# EAGLE design Mega_Shield-v13 (EAGLE 6.5.0)
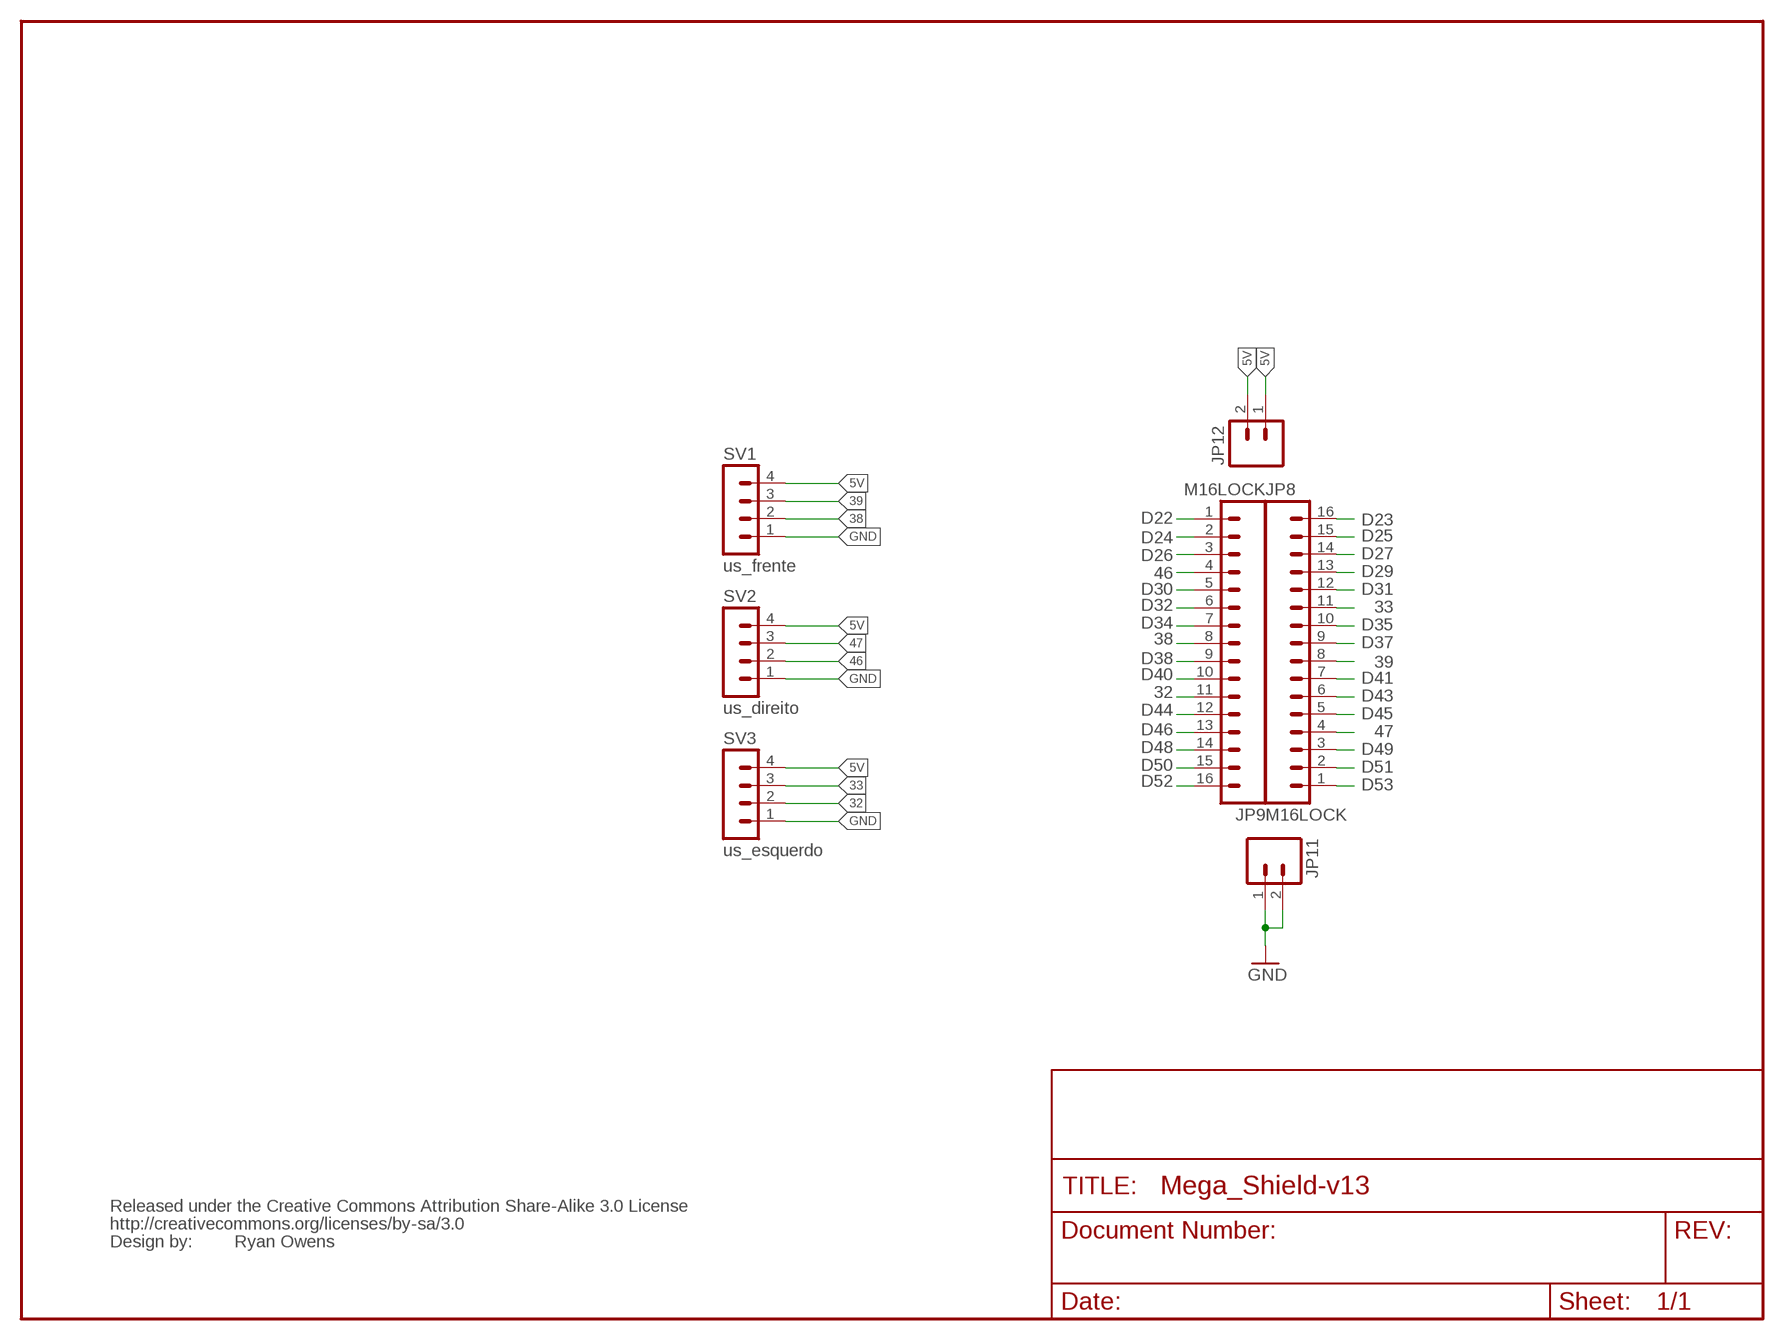
[diagram p0: schematic, sheet 1]

## Parts
JP8  M16LOCK  [1X16_LOCK]
JP9  M16LOCK  [1X16_LOCK]
JP11  M02LOCK  [1X02_LOCK]
JP12  M02LOCK  [1X02_LOCK]
SV1  us_frente  MA04-1  [MA04-1]
SV2  us_direito  MA04-1  [MA04-1]
SV3  us_esquerdo  MA04-1  [MA04-1]
U$2  CREATIVE_COMMONS  [CREATIVE_COMMONS]

## Nets
5V: JP12.1 JP12.2 SV1.4 SV2.4 SV3.4
32: JP9.11 SV3.2
33: JP8.11 SV3.3
38: JP9.8 SV1.2
39: JP8.8 SV1.3
46: JP9.4 SV2.2
47: JP8.4 SV2.3
D22: JP9.1
D23: JP8.16
D24: JP9.2
D25: JP8.15
D26: JP9.3
D27: JP8.14
D29: JP8.13
D30: JP9.5
D31: JP8.12
D32: JP9.6
D34: JP9.7
D35: JP8.10
D37: JP8.9
D38: JP9.9
D40: JP9.10
D41: JP8.7
D43: JP8.6
D44: JP9.12
D45: JP8.5
D46: JP9.13
D48: JP9.14
D49: JP8.3
D50: JP9.15
D51: JP8.2
D52: JP9.16
D53: JP8.1
GND: JP11.1 JP11.2 SV1.1 SV2.1 SV3.1

## Notes on the sheet
- Ryan Owens

## Library data of the parts
JP8 JP9 = SparkFun:M16
JP11 JP12 = SparkFun:M02: Header 2 Standard 2-pin 0.1" header. Use with straight break away headers (SKU : PRT-00116), right angle break away headers (PRT-00553), swiss pins (PRT-00743), machine pins (PRT-00117), and female headers (PRT-00115). Molex polarized connector foot print use with SKU : PRT-08233 with associated crimp pins and housings.
SV1-SV3 = con-lstb:MA04-1: PIN HEADER; OC_FARNELL: unknown; OC_NEWARK: unknown
U$2 = SparkFun:CREATIVE_COMMONS

## Board
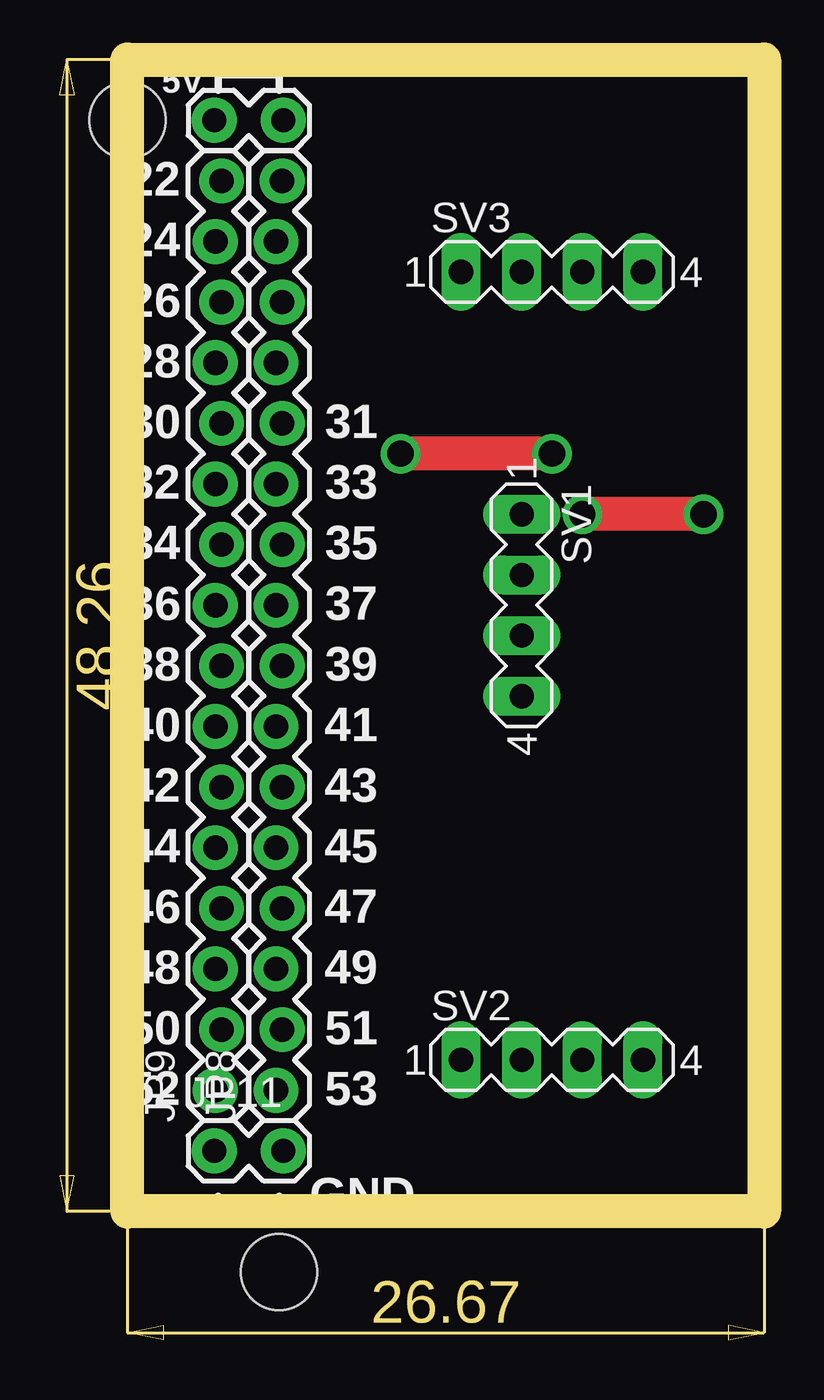
[diagram p1: board, top side]
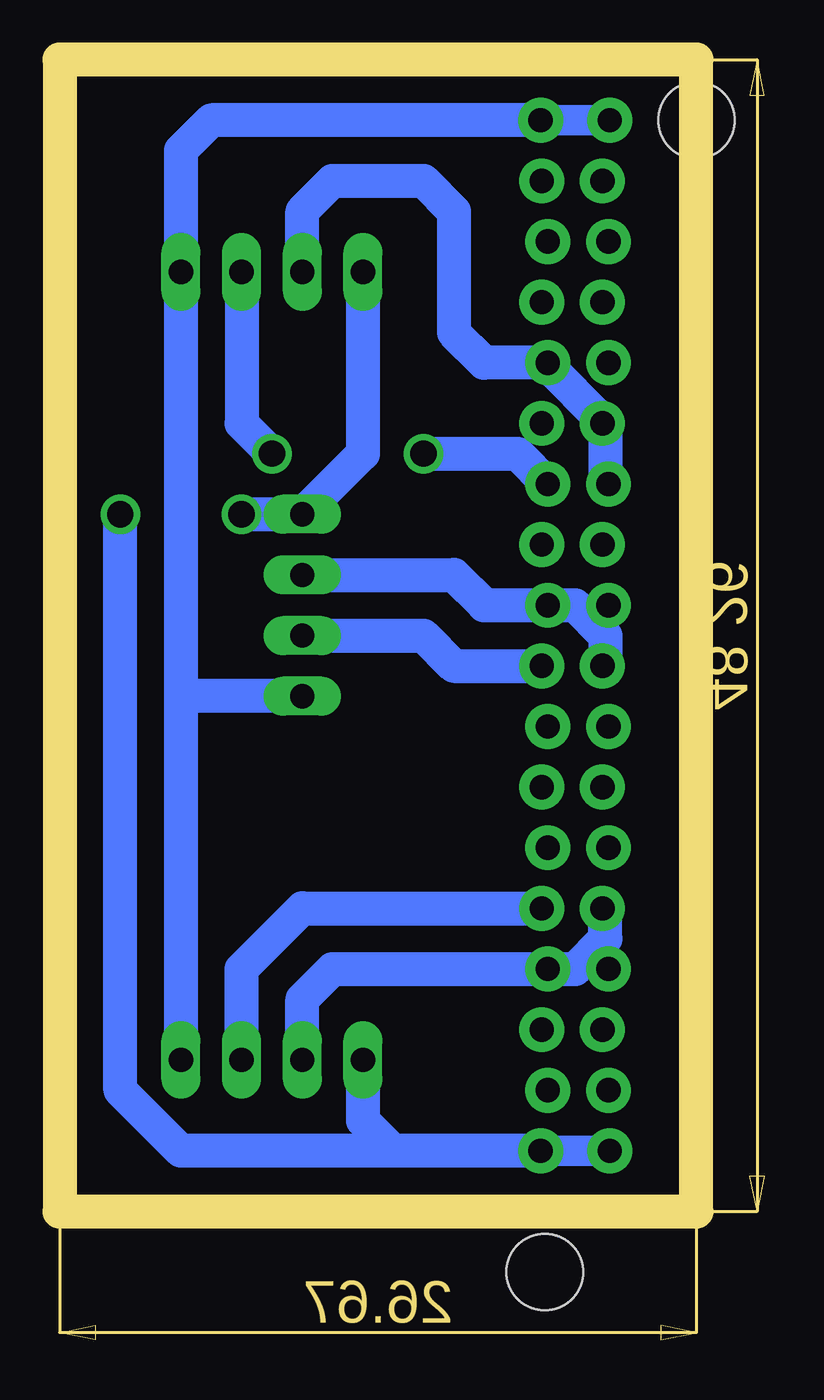
[diagram p2: board, bottom side, seen from below]

Size 26.67 x 48.26 mm. Coordinates in mm from the lower left corner, seen from the top.
Outline: 0,48.26 26.67,48.26 26.67,0 0,0 0,48.26
Copper layers (1*16): Top 0.035mm / dielectric 1.5mm / Bottom 0.035mm
Design rules "SparkFun": minimum track width 8mil, minimum drill 20mil, track to track 8mil, track to pad 8mil, pad to pad 8mil, via to via 8mil, smd to smd 8mil, copper to edge 10mil, drill to drill 8mil, minimum pad ring 12mil, minimum via ring 10mil, stop-mask expansion 4mil, vias tented up to drill 25mil, thermal gap 10mil
Holes 3.2 mm at 0,45.72 6.35,-2.54

### Footprints (pad centres in the part's own frame; a part is rotated, then mirrored left to right if it is on the bottom)
1X16_LOCK = drill 1.016 pad 1.88: 1 0,0.127; 2 2.54,-0.127; 3 5.08,0.127; 4 7.62,-0.127; 5 10.16,0.127; 6 12.7,-0.127; 7 15.24,0.127; 8 17.78,-0.127; 9 20.32,0.127; 10 22.86,-0.127; 11 25.4,0.127; 12 27.94,-0.127; 13 30.48,0.127; 14 33.02,-0.127; 15 35.56,0.127; 16 38.1,-0.127
1X02_LOCK = drill 1.016 pad 1.88: 1 -0.178,0; 2 2.718,0
MA04-1 = drill 1.016 long: 1 -3.81,0; 2 -1.27,0; 3 1.27,0; 4 3.81,0

### Placement (x,y rotation side)
JP8  6.35,5.08 90 top
JP9  3.81,5.08 90 top
JP11  3.81,2.54 0 top
JP12  3.81,45.72 0 top
SV1  16.51,25.4 270 top
SV2  17.78,6.35 0 top
SV3  17.78,39.37 0 top
U$2  11.43,-15.24 0 top  (outside the outline)

### Tracks (layer width: path | path; a pad name or v marks a point on that pad's centre or on a via)
5V
  Bottom 1.27: JP12.1 6.35,45.72
  Bottom 1.422: 6.35,45.72 JP12.2 20.32,45.72 21.59,44.45 SV3.4 21.59,21.59 | 21.59,21.59 SV2.4 | SV1.4 21.59,21.59
32
  Bottom 1.422: JP9.11 3.81,30.61 3.81,33.02 6.35,35.56 8.89,35.56 10.16,36.83 10.16,41.91 11.43,43.18 15.24,43.18 16.51,41.91 SV3.2
33  (via drill 0.6, 1.1)
  Top 1.422: v17.78,31.75 v11.43,31.75
  Bottom 1.422: SV3.3 19.05,33.02 v17.78,31.75 | v11.43,31.75 7.49,31.75 JP8.11
38
  Bottom 1.422: SV1.2 10.16,26.67 8.89,25.4 5.08,25.4 3.81,24.13 3.81,22.99 JP9.8
39
  Bottom 1.422: SV1.3 11.43,24.13 10.16,22.86 JP8.8
46
  Bottom 1.422: SV2.2 16.51,8.89 15.24,10.16 5.08,10.16 3.81,11.43 3.81,12.57 JP9.4
47
  Bottom 1.422: SV2.3 19.05,10.16 16.51,12.7 JP8.4
GND  (via drill 1.1)
  Top 1.422: v24.13,29.21 v19.05,29.21
  Bottom 1.27: 3.81,2.54 JP11.2
  Bottom 1.422: JP11.2 12.7,2.54 | SV3.1 13.97,31.75 SV1.1 v19.05,29.21 | 3.81,2.54 JP11.1 | SV2.1 13.97,3.81 12.7,2.54 | 12.7,2.54 21.59,2.54 24.13,5.08 v24.13,29.21

### Text on the board
tPlace: 5V | 22 | 24 | 26 | 28 | 30 | 31 | 32 | 33 | 34 | 35 | 36 | 37 | 38 | 39 | 40 | 41 | 42 | 43 | 44 | 45 | 46 | 47 | 48 | 49 | 50 | 51 | 52 | 53 | GND